# Altium schematic sheet PowerSupplies.SchDoc: Switching power supply
size 420 x 297 mm; CheckedBy: MC, TW, EB; CompanyName: CERN; DrawnBy: Greg Kasprowicz; Organization: CERN; Address1: European Organization for Nuclear Research; Address2: CH-1211 Geneve 23 - SwitzerLA_Pd; DocumentNumber: 3; Revision: -; SheetNumber: 11; SheetTotal: 15; EDA_Number: EDA-02189-V4-0; Projet: Simple PCIe Carrier Board; ModifiedBy: TW, MC; CreateDate: 10/07/2010; CheckedDate: 11/05/2011; DivGrp: BE-CO; Designer: GK, MC, TW, EB, PAS; PageSetup: Record=PageOptions|CenterHorizontal=True|CenterVertical=True|PrintScale=0.96|XCorrection=1.00|YCorrection=1.00|PrintKind=1|BorderSize=5000000|LeftOffset=0|BottomOffset=0|Orientation=2|PaperLength=1000|PaperWidth=1000|Scale=100|PaperSource=15|PrintQuality=600|MediaType=1|DitherType=10|PaperKind=A3|PrintScaleMode=1; ModifiedDate: -
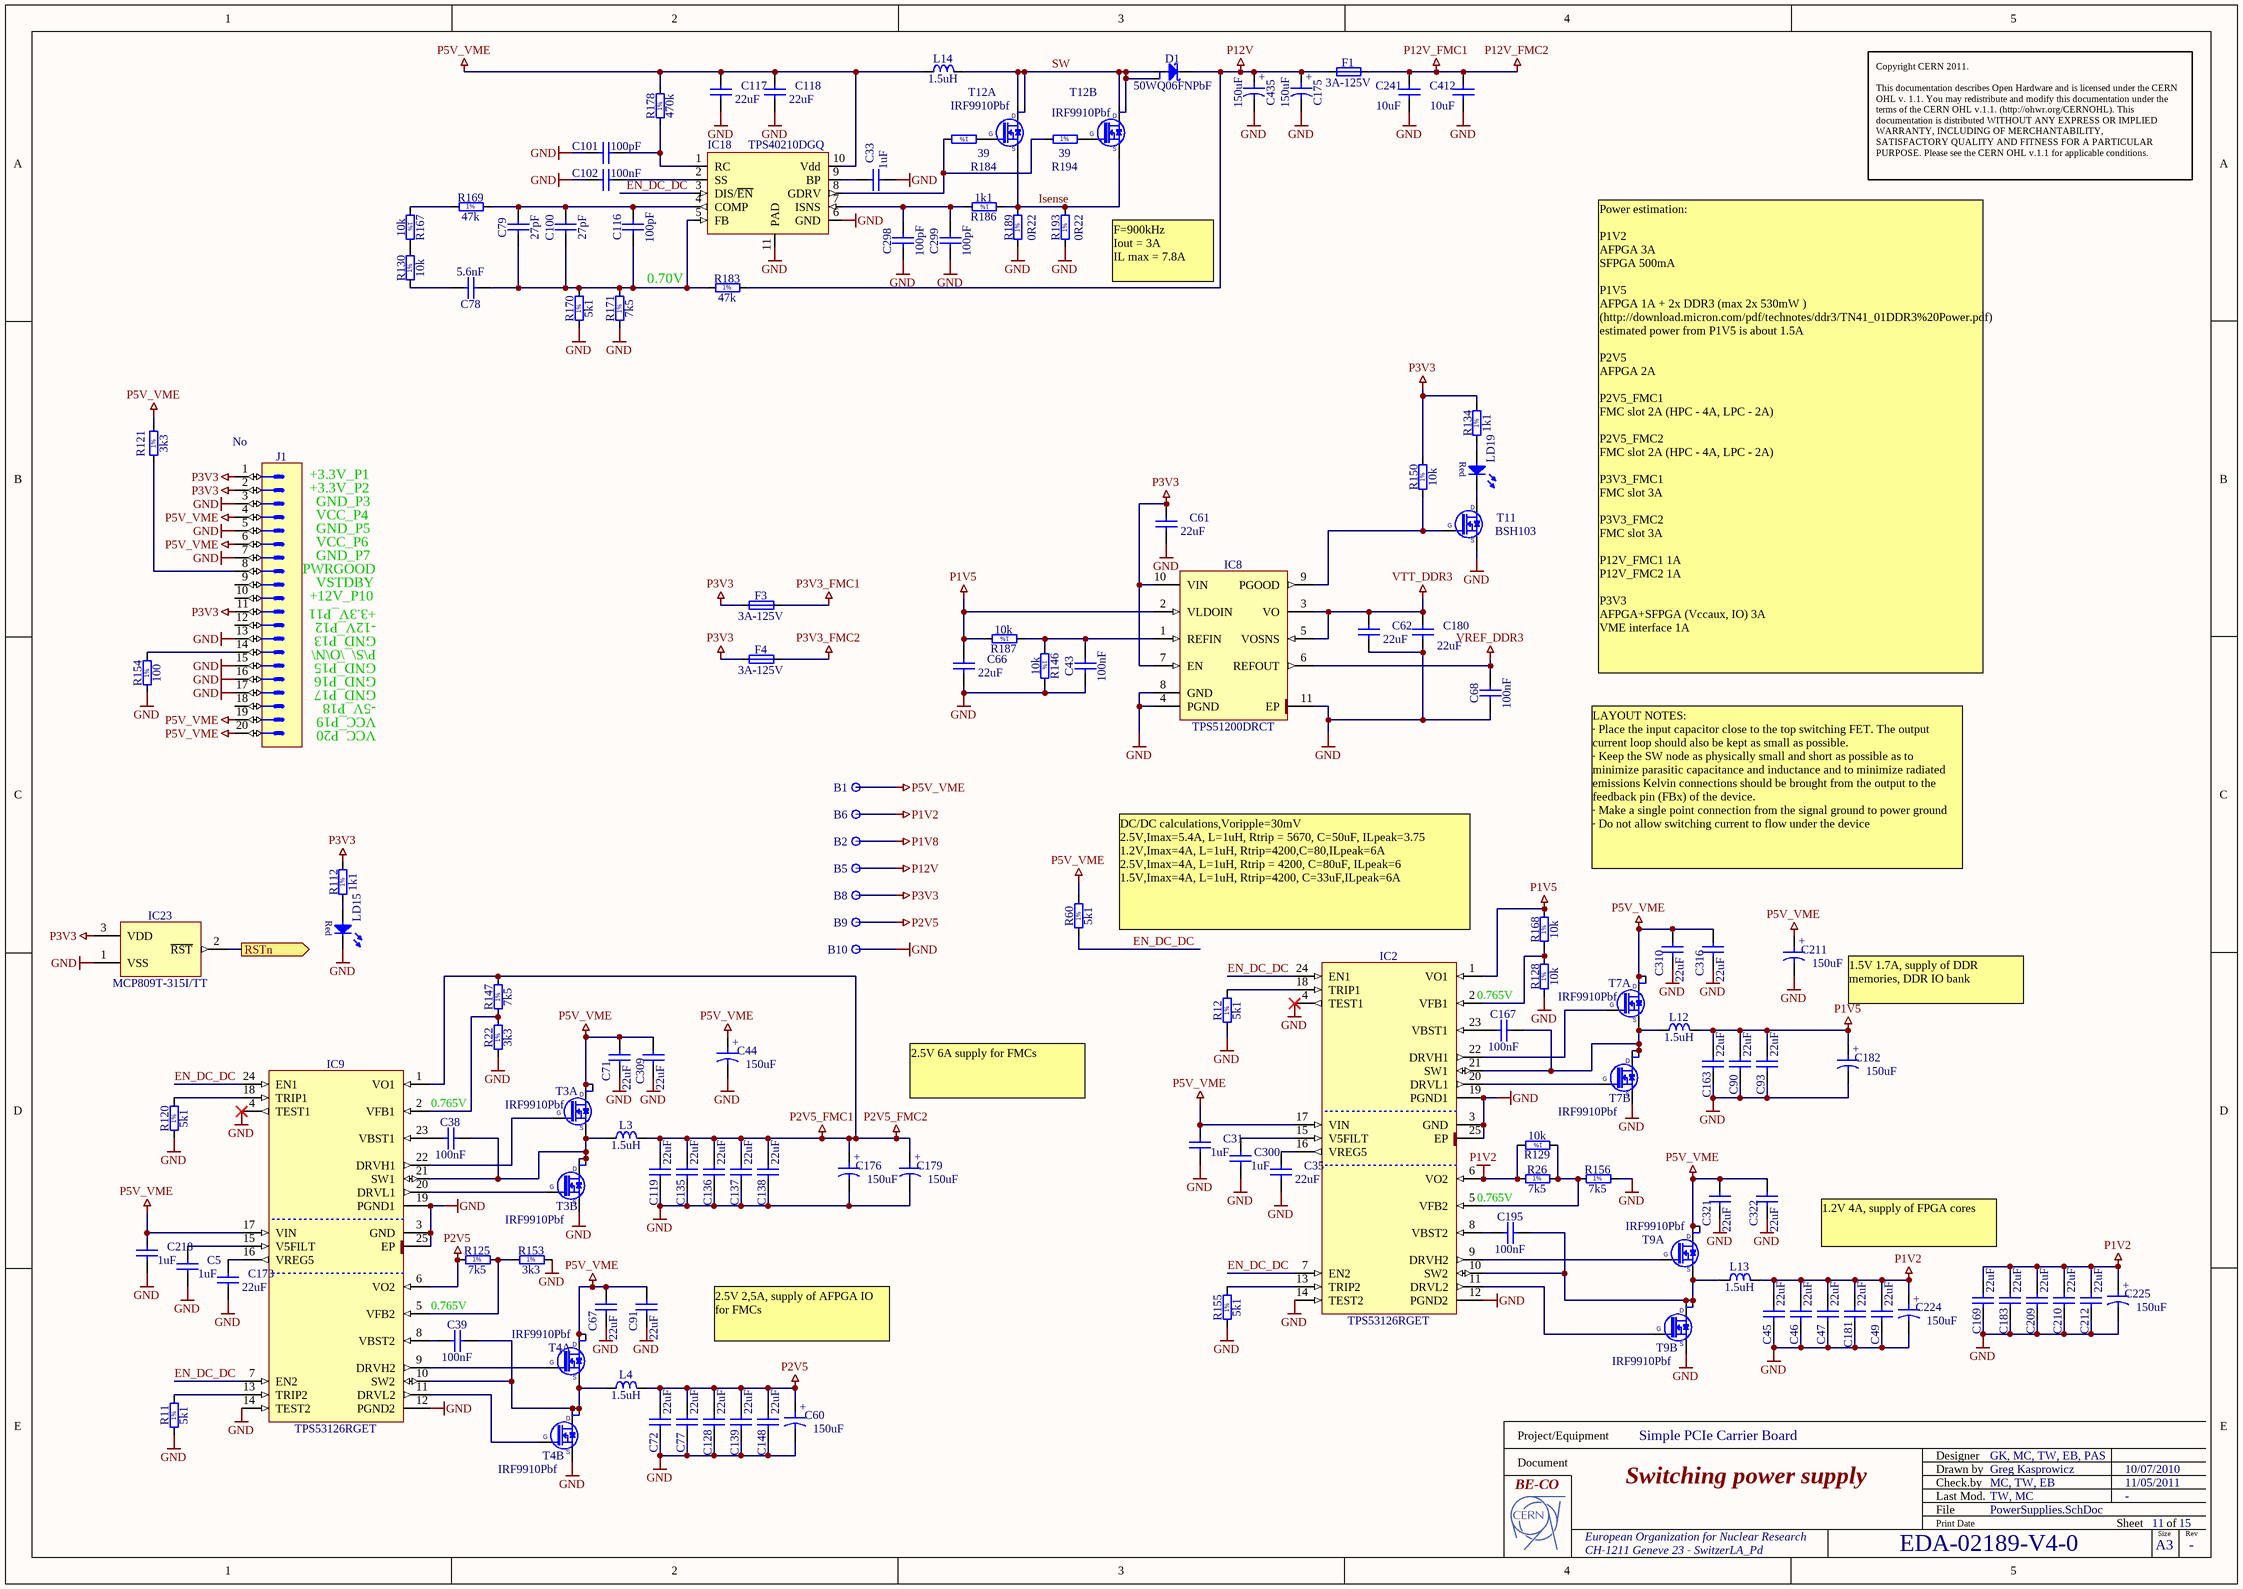
[diagram p0: PowerSupplies.SchDoc]

## Parts
B1  Plated Hole  [c130h80]  (value not drawn)
B2  Plated Hole  [c130h80]  (value not drawn)
B5  Plated Hole  [c130h80]  (value not drawn)
B6  Plated Hole  [c130h80]  (value not drawn)
B8  Plated Hole  [c130h80]  (value not drawn)
B9  Plated Hole  [c130h80]  (value not drawn)
B10  Plated Hole  [c130h80]  (value not drawn)
C5  1uF  [CAPC1608X87N]
C31  1uF  [CAPC1608X87N]
C33  1uF  [CAPC1608X87N]
C35  22uF  [CAPC3216X180N]
C38  100nF  [CAPC1005X55N]
C39  100nF  [CAPC1005X55N]
C43  100nF  [CAPC1005X55N]
C44  150uF  [CAPPR350-850X700]
C45  22uF  [CAPC3216X180N]
C46  22uF  [CAPC3216X180N]
C47  22uF  [CAPC3216X180N]
C49  22uF  [CAPC3216X180N]
C60  150uF  [CAPPR350-850X700]
C61  22uF  [CAPC3216X180N]
C62  22uF  [CAPC3216X180N]
C66  22uF  [CAPC3216X180N]
C67  22uF  [CAPC3216X180N]
C68  100nF  [CAPC1005X55N]
C71  22uF  [CAPC3216X180N]
C72  22uF  [CAPC3216X180N]
C77  22uF  [CAPC3216X180N]
C78  5.6nF  [CAPC1608X87N]
C79  27pF  [CAPC1608X87N]
C90  22uF  [CAPC3216X180N]
C91  22uF  [CAPC3216X180N]
C93  22uF  [CAPC3216X180N]
C100  27pF  [CAPC1608X87N]
C101  100pF  [CAPC1608X87N]
C102  100nF  [CAPC1005X55N]
C116  100pF  [CAPC1608X87N]
C117  22uF  [CAPC3216X180N]
C118  22uF  [CAPC3216X180N]
C119  22uF  [CAPC3216X180N]
C128  22uF  [CAPC3216X180N]
C135  22uF  [CAPC3216X180N]
C136  22uF  [CAPC3216X180N]
C137  22uF  [CAPC3216X180N]
C138  22uF  [CAPC3216X180N]
C139  22uF  [CAPC3216X180N]
C148  22uF  [CAPC3216X180N]
C163  22uF  [CAPC3216X180N]
C167  100nF  [CAPC1005X55N]
C169  22uF  [CAPC3216X180N]
C173  22uF  [CAPC3216X180N]
C175  150uF  [CAPPR500-1050X800]
C176  150uF  [CAPPR350-850X700]
C179  150uF  [CAPPR350-850X700]
C180  22uF  [CAPC3216X180N]
C181  22uF  [CAPC3216X180N]
C182  150uF  [CAPPR350-850X700]
C183  22uF  [CAPC3216X180N]
C195  100nF  [CAPC1005X55N]
C209  22uF  [CAPC3216X180N]
C210  22uF  [CAPC3216X180N]
C211  150uF  [CAPPR350-850X700]
C212  22uF  [CAPC3216X180N]
C218  1uF  [CAPC1608X87N]
C224  150uF  [CAPPR350-850X700]
C225  150uF  [CAPPR350-850X700]
C241  10uF  [CAPC3225X270N]
C298  100pF  [CAPC1608X87N]
C299  100pF  [CAPC1608X87N]
C300  1uF  [CAPC1608X87N]
C309  22uF  [CAPC3216X180N]
C310  22uF  [CAPC3216X180N]
C316  22uF  [CAPC3216X180N]
C321  22uF  [CAPC3216X180N]
C322  22uF  [CAPC3216X180N]
C412  10uF  [CAPC3225X270N]
C435  150uF  [CAPPR500-1050X800]
D1  50WQ06FNPbF  [TO228P991X239-3N-R546X521]
F1  3A-125V  [FUSE_LITTELFUSE_0154]
F3  3A-125V  [FUSE_LITTELFUSE_0154]
F4  3A-125V  [FUSE_LITTELFUSE_0154]
IC2  TPS53126RGET  [QFN50P400X400X100-25N-S255]
IC8  TPS51200DRCT  [SON50P300X300X100-11N-R175X250]
IC9  TPS53126RGET  [QFN50P400X400X100-25N-S255]
IC18  TPS40210DGQ  [MSOP10_thermal]
IC23  MCP809T-315I/TT  [SOT95P237X112-3N]
J1  Mounted: No  [MOLEX_39-28-1203]  (hidden comment: Mini-Fit Jr.™)
L3  1.5uH  [IND_BOURNS_SRR1260]
L4  1.5uH  [IND_BOURNS_SRR1260]
L12  1.5uH  [IND_BOURNS_SRR1260]
L13  1.5uH  [IND_BOURNS_SRR1260]
L14  1.5uH  [IND_BOURNS_SRR1260]
LD15  Red  [LEDC1608X80N_RED]  (value not drawn)
LD19  Red  [LEDC1608X80N_RED]  (value not drawn)
R11  5k1  [RESC1608X55N]
R12  5k1  [RESC1608X55N]
R22  3k3  [RESC1608X55N]
R26  7k5  [RESC1608X55N]
R60  5k1  [RESC1608X55N]
R112  1k1  [RESC1608X55N]
R120  5k1  [RESC1608X55N]
R121  3k3  [RESC1608X55N]
R125  7k5  [RESC1608X55N]
R128  10k  [RESC1608X55N]
R129  10k  [RESC1608X55N]
R130  10k  [RESC1608X55N]
R134  1k1  [RESC1608X55N]
R146  10k  [RESC1608X55N]
R147  7k5  [RESC1608X55N]
R150  10k  [RESC1608X55N]
R153  3k3  [RESC1608X55N]
R154  100  [RESC1608X55N]
R155  5k1  [RESC1608X55N]
R156  7k5  [RESC1608X55N]
R167  10k  [RESC1608X55N]
R168  10k  [RESC1608X55N]
R169  47k  [RESC1608X55N]
R170  5k1  [RESC1608X55N]
R171  7k5  [RESC1608X55N]
R178  470k  [RESC1608X55N]
R183  47k  [RESC1608X55N]
R184  39  [RESC1608X55N]
R186  1k1  [RESC1608X55N]
R187  10k  [RESC1608X55N]
R189  0R22  [RESC3216X65N]
R193  0R22  [RESC3216X65N]
R194  39  [RESC1608X55N]
T3  IRF9910Pbf  [SOIC127P600X175-8N]  (parts A,B of 2)
T4  IRF9910Pbf  [SOIC127P600X175-8N]  (parts A,B of 2)
T7  IRF9910Pbf  [SOIC127P600X175-8N]  (parts A,B of 2)
T9  IRF9910Pbf  [SOIC127P600X175-8N]  (parts A,B of 2)
T11  BSH103  [SOT95P230X110-3N]
T12  IRF9910Pbf  [SOIC127P600X175-8N]  (parts A,B of 2)

## Ports
RSTn (out)

## Nets
GND: B10.1 C5.1 C31.1 C33.1 C35.1 C43.1 C44.2 C45.1 C46.1 C47.1 C49.1 C60.2 C61.1 C62.1 C66.1 C67.1 C68.1 C71.1 C72.1 C77.1 C90.1 C91.1 C93.1 C101.1 C102.1 C117.1 C118.1 C119.1 C128.1 C135.1 C136.1 C137.1 C138.1 C139.1 C148.1 C163.1 C169.1 C173.1 C175.2 C176.2 C179.2 C180.1 C181.1 C182.2 C183.1 C209.1 C210.1 C211.2 C212.1 C218.1 C224.2 C225.2 C241.2 C298.1 C299.1 C300.1 C309.1 C310.1 C316.1 C321.1 C322.1 C412.2 C435.2 IC2.3(GND) IC2.4(TEST1) IC2.12(PGND2) IC2.14(TEST2) IC2.19(PGND1) IC2.25(EP) IC8.4(PGND) IC8.8(GND) IC8.11(EP) IC9.3(GND) IC9.4(TEST1) IC9.12(PGND2) IC9.14(TEST2) IC9.19(PGND1) IC9.25(EP) IC18.6(GND) IC18.11(PAD) IC23.1(VSS) J1.3 J1.5 J1.7 J1.13 J1.15 J1.16 J1.17 LD15.1(C) R11.1 R12.1 R22.1 R120.1 R128.1 R146.2 R153.2 R154.1 R155.1 R156.2 R170.1 R171.1 R189.1 R193.1 T3.1(S) T4.1(S) T7.1(S) T9.1(S) T11.2(S)
P1V2: B6.1 C45.2 C46.2 C47.2 C49.2 C169.2 C181.2 C183.2 C209.2 C210.2 C212.2 C224.1 C225.1 IC2.6(VO2) L13.2 R26.1 R129.2
P1V5: C66.2 C90.2 C93.2 C163.2 C182.1 IC2.1(VO1) IC8.2(VLDOIN) L12.2 R168.2 R187.2
P1V8: B2.1
P2V5: B9.1 C60.1 C72.2 C77.2 C128.2 C139.2 C148.2 IC9.6(VO2) L4.2 R125.1
P2V5_FMC1: C119.2 C135.2 C136.2 C137.2 C138.2 C176.1 C179.1 IC9.1(VO1) L3.2 R147.2  [also labelled P2V5_FMC2]
P3V3: B8.1 C61.2 F3.1 F4.1 IC8.7(EN) IC8.10(VIN) IC23.3(VDD) J1.1 J1.2 J1.11 R112.2 R134.2 R150.2
P3V3_FMC1: F3.2
P3V3_FMC2: F4.2
P5V_VME: B1.1 C31.2 C44.1 C67.2 C71.2 C91.2 C117.2 C118.2 C211.1 C218.2 C309.2 C310.2 C316.2 C321.2 C322.2 IC2.17(VIN) IC9.17(VIN) IC18.10(Vdd) J1.4 J1.6 J1.19 J1.20 L14.1 R60.2 R121.2 R178.2 T3.5(D) T3.6(D) T4.5(D) T4.6(D) T7.5(D) T7.6(D) T9.5(D) T9.6(D)
P12V: B5.1 C175.1 C435.1 D1.3(C) F1.1 R183.2
P12V_FMC1: C241.1 C412.1 F1.2  [also labelled P12V_FMC2]
VREF_DDR3: C68.2 IC8.6(REFOUT)
VTT_DDR3: C62.2 C180.2 IC8.3(VO) IC8.5(VOSNS)
EN_DC_DC: IC2.7(EN2) IC2.24(EN1) IC9.7(EN2) IC9.24(EN1) IC18.3(DIS/~{EN}) R60.1
Isense: R186.1 R189.2 R193.2 T12.1(S) T12.3(S)
RSTn: IC23.2(~{RST}) ; port RSTn
SW: D1.1(A) D1.2(A) L14.2 T12.5(D) T12.6(D) T12.7(D) T12.8(D)
NetC5_2: C5.2 IC9.15(V5FILT)
NetC33_2: C33.2 IC18.9(BP)
NetC35_2: C35.2 IC2.16(VREG5)
NetC38_1: C38.1 IC9.23(VBST1)
NetC38_2: C38.2 IC9.21(SW1) L3.1 T3.3(S) T3.7(D) T3.8(D)
NetC39_1: C39.1 IC9.8(VBST2)
NetC39_2: C39.2 IC9.10(SW2) L4.1 T4.3(S) T4.7(D) T4.8(D)
NetC43_2: C43.2 IC8.1(REFIN) R146.1 R187.1
NetC78_1: C78.1 C79.1 C100.1 C116.1 IC18.5(FB) R170.2 R171.2 R183.1
NetC78_2: C78.2 R130.1
NetC79_2: C79.2 C100.2 C116.2 IC18.4(COMP) R169.2
NetC101_2: C101.2 IC18.1(RC) R178.1
NetC102_2: C102.2 IC18.2(SS)
NetC167_1: C167.1 IC2.23(VBST1)
NetC167_2: C167.2 IC2.21(SW1) L12.1 T7.3(S) T7.7(D) T7.8(D)
NetC173_2: C173.2 IC9.16(VREG5)
NetC195_1: C195.1 IC2.8(VBST2)
NetC195_2: C195.2 IC2.10(SW2) L13.1 T9.3(S) T9.7(D) T9.8(D)
NetC298_2: C298.2 C299.2 IC18.7(ISNS) R186.2
NetC300_2: C300.2 IC2.15(V5FILT)
NetIC2_2: IC2.2(VFB1) R128.2 R168.1
NetIC2_5: IC2.5(VFB2) R26.2 R129.1 R156.1
NetIC2_9: IC2.9(DRVH2) T9.4(G)
NetIC2_11: IC2.11(DRVL2) T9.2(G)
NetIC2_13: IC2.13(TRIP2) R155.2
NetIC2_18: IC2.18(TRIP1) R12.2
NetIC2_20: IC2.20(DRVL1) T7.2(G)
NetIC2_22: IC2.22(DRVH1) T7.4(G)
NetIC8_9: IC8.9(PGOOD) R150.1 T11.1(G)
NetIC9_2: IC9.2(VFB1) R22.2 R147.1
NetIC9_5: IC9.5(VFB2) R125.2 R153.1
NetIC9_9: IC9.9(DRVH2) T4.4(G)
NetIC9_11: IC9.11(DRVL2) T4.2(G)
NetIC9_13: IC9.13(TRIP2) R11.2
NetIC9_18: IC9.18(TRIP1) R120.2
NetIC9_20: IC9.20(DRVL1) T3.2(G)
NetIC9_22: IC9.22(DRVH1) T3.4(G)
NetIC18_8: IC18.8(GDRV) R184.2 R194.1
NetJ1_8: J1.8 R121.1
NetJ1_14: J1.14 R154.2
NetLD15_2: LD15.2(A) R112.1
NetLD19_1: LD19.1(C) T11.3(D)
NetLD19_2: LD19.2(A) R134.1
NetR130_2: R130.2 R167.2
NetR167_1: R167.1 R169.1
NetR184_1: R184.1 T12.4(G)
NetR194_2: R194.2 T12.2(G)

Not connected (* = marked no-connect by the designer): J1 9 10 12 18

## Notes on the sheet
- Copyright CERN 2011.
  This documentation describes Open Hardware and is licensed under the CERN OHL v. 1.1. You may redistribute and modify this documentation under the terms of the CERN OHL v.1.1. (http://ohwr.org/CERNOHL). This documentation is distributed WITHOUT ANY EXPRESS OR IMPLIED WARRANTY, INCLUDING OF MERCHANTABILITY, SATISFACTORY QUALITY AND FITNESS FOR A PARTICULAR PURPOSE. Please see the CERN OHL v.1.1 for applicable conditions.
- 0.70V
- (near R193) F=900kHz
  Iout = 3A
  IL max = 7.8A
- (near J1) +3.3V_P1
- (near J1) +3.3V_P2
- GND_P3
- VCC_P4
- GND_P5
- (near J1) PWRGOOD
- VCC_P6
- GND_P7
- VSTDBY
- (near J1) +12V_P10
- (near J1) +3.3V_P11
- -12V_P12
- GND_P13
- (near J1) P\S\_\O\N\
- GND_P15
- GND_P16
- Power estimation:
  P1V2
  AFPGA 3A
  SFPGA 500mA
  P1V5
  AFPGA 1A + 2x DDR3 (max 2x 530mW )
  (http://download.micron.com/pdf/technotes/ddr3/TN41_01DDR3%20Power.pdf)
  estimated power from P1V5 is about 1.5A
  P2V5
  AFPGA 2A
  P2V5_FMC1
  FMC slot 2A (HPC - 4A, LPC - 2A)
  P2V5_FMC2
  FMC slot 2A (HPC - 4A, LPC - 2A)
  P3V3_FMC1
  FMC slot 3A
  P3V3_FMC2
  FMC slot 3A
  P12V_FMC1 1A
  P12V_FMC2 1A
  P3V3
  AFPGA+SFPGA (Vccaux, IO) 3A
  VME interface 1A
- GND_P17
- -5V_P18
- VCC_P19
- VCC_P20
- LAYOUT NOTES:
  · Place the input capacitor close to the top switching FET. The output current loop should also be kept as small as possible.
  · Keep the SW node as physically small and short as possible as to minimize parasitic capacitance and inductance and to minimize radiated emissions Kelvin connections should be brought from the output to the feedback pin (FBx) of the device.
  · Make a single point connection from the signal ground to power ground
  · Do not allow switching current to flow under the device
- DC/DC calculations,Voripple=30mV
  2.5V,Imax=5.4A, L=1uH, Rtrip = 5670, C=50uF, ILpeak=3.75
  1.2V,Imax=4A, L=1uH, Rtrip=4200,C=80,ILpeak=6A
  2.5V,Imax=4A, L=1uH, Rtrip = 4200, C=80uF, ILpeak=6
  1.5V,Imax=4A, L=1uH, Rtrip=4200, C=33uF,ILpeak=6A
- 0.765V
- 1.5V 1.7A, supply of DDR memories, DDR IO bank
- 2.5V 6A supply for FMCs
- 1.2V 4A, supply of FPGA cores
- 2.5V 2,5A, supply of AFPGA IO for FMCs
- Project/Equipment
- Document
- Designer
- Drawn by
- Check.by
- File
- Last Mod.
- Print Date
- Sheet
- Size
- A3
- of
- Rev
- (in symbol CAER_150UF_6.3V_20%_SANYO_6SEQP150M) +
- (in symbol CAER_150UF_16V_20%_SANYO_16SEQP150M) +
- (in symbol R0603_1K1_1%_0.1W_100PPM) 1%
- (in symbol R0603_3K3_1%_0.1W_100PPM) 1%
- (in symbol R0603_5K1_1%_0.1W_100PPM) 1%
- (in symbol R0603_7K5_1%_0.1W_100PPM) 1%
- (in symbol R0603_10K_1%_0.1W_100PPM) 1%
- (in symbol R0603_39R_1%_0.1W_100PPM) 1%
- (in symbol R0603_47K_1%_0.1W_100PPM) 1%
- (in symbol R0603_100R_1%_0.1W_100PPM) 1%
- (in symbol R0603_470K_1%_0.1W_100PPM) 1%
- (in symbol R1206_0R22_1%_0.5W_600PPM) 1%

## Library data of the parts
B1 B2 B5 B6 B8-B10 = PLATED_HOLE0.8_PAD1.3: Single Terminal Socket; Part Description: Plated Through Hole: Hole Dia.=0.8mm Pad Dia.=1.3mm; Mounted: No; Table: Pads; Part Number: PLATED_HOLE0.8_PAD1.3; Component Kind: Standard (No BOM); Component Type: Standard (No BOM); Pin Count: 1; Family: Plated Hole; Socket: No; SMD: No; Status: None; ComponentHeight: 0mm; Author: CERN DEM JLC; CreateDate: 2008-10-30; LatestRevisionDate: 2008-10-30; PackageDescription: Plated Through Hole: Hole Dia.=0.8mm Pad Dia.=1.3mm
C5 C31 C33 C218 C300 = CC0603_1UF_16V_10%_X7R: Non-polarised capacitor; Part Description: SMD Multilayer Chip Ceramic Capacitor; Manufacturer: GENERIC; Manufacturer1 Part Number: 223824613663; Voltage: 16V; TC: X7R; Tolerance: ±10%; Table: Capacitors SMD; Part Number: CC0603_1UF_16V_10%_X7R; Component Kind: Standard; Component Type: Standard; Pin Count: 2; Value: 1uF; Status: Preferred; Manufacturer Part Number: CC0603_1uF_16V_10%_X7R; Case: 0603; Mounted: Yes; Socket: No; SMD: Yes; Manufacturer1 Example: PHYCOMP; Manufacturer1 ComponentHeight: 0.87mm; HelpURL: \\cern.ch\dfs\Applications\Altium\Datasheets\CC0805_X5R_PHYCOMP_HC.pdf; Author: CERN DEM JLC
  C5 C33 C300: CreateDate: 03/12/2007; LatestRevisionDate: 03/12/2007
  C31 C218: CreateDate: 12/3/2007; LatestRevisionDate: 12/3/2007
C35 C45-C47 C49 C61 C62 C66 C67 C71 C72 C77 C90 C91 C93 C117-C119 C128 C135-C139 C148 C163 C169 C173 C180 C181 C183 C209 C210 C212 C309 C310 C316 C321 C322 = CC1206_22UF_10V_10%_X7R: Non-polarised capacitor; Part Description: SMD Multilayer Chip Ceramic Capacitor; Manufacturer: GENERIC; Manufacturer1 Part Number: GRM31CR71A226KE15L; Voltage: 10V; TC: X7R; Tolerance: ±10%; Table: Capacitors SMD; Part Number: CC1206_22UF_10V_10%_X7R; Component Kind: Standard; Component Type: Standard; Pin Count: 2; Value: 22uF; Status: Preferred; Manufacturer Part Number: CC1206_22UF_10V_10%_X7R; Case: 1206; Mounted: Yes; Socket: No; SMD: Yes; Manufacturer1 Example: MURATA; Manufacturer1 ComponentHeight: 1.8mm; HelpURL: \\cern.ch\dfs\Applications\Altium\Datasheets\CC1206_X7R_MURATA_GRM-HI-CAP.pdf; Author: CERN DEM JLC; CreateDate: 2010-06-08; LatestRevisionDate: 2010-06-08
C38 C39 C43 C102 C167 C195 = CC0402_100NF_16V_10%_X7R: Non-polarised capacitor; Part Description: SMD Multilayer Chip Ceramic Capacitor; Manufacturer: GENERIC; Manufacturer1 Part Number: 223878715649; Voltage: 16V; TC: X7R; Tolerance: ±10%; Table: Capacitors SMD; Part Number: CC0402_100NF_16V_10%_X7R; Component Kind: Standard; Component Type: Standard; Pin Count: 2; Value: 100nF; Status: Not Recommended; Manufacturer Part Number: CC0402_100NF_16V_10%_X7R; Case: 0402; Mounted: Yes; Socket: No; SMD: Yes; Manufacturer1 Example: PHYCOMP; Manufacturer1 ComponentHeight: 0.55mm; HelpURL: \\cern.ch\dfs\Applications\Altium\Datasheets\CC0402_X7R_PHYCOMP.pdf; Author: CERN DEM JLC
  C38 C39 C102 C167 C195: CreateDate: 2007-12-03; LatestRevisionDate: 2007-12-03
  C43: CreateDate: 12/3/2007; LatestRevisionDate: 12/3/2007
C44 C60 C176 C179 C182 C211 C224 C225 = CAER_150UF_6.3V_20%_SANYO_6SEQP150M: Polarised capacitor; Part Description: Aluminium Solid Capacitor With Conductive Polymer (SEQP Serie); Manufacturer: SANYO OS-CON; Voltage: 6.3V; Tolerance: ±20%; Table: Capacitors THD; Part Number: CAER_150UF_6.3V_20%_SANYO_6SEQP150M; Component Kind: Standard; Component Type: Standard; Pin Count: 2; Value: 150uF; Status: Not Recommended; Manufacturer Part Number: 6SEQP150M; Case: LS3.5 D8 x H7; Mounted: Yes; Socket: No; SMD: No; ComponentHeight: 7mm; HelpURL: \\cern.ch\dfs\Applications\Altium\Datasheets\CAER_SANYO_SEQP.pdf; Author: CERN DEM JLC; CreateDate: 2011-03-07; LatestRevisionDate: 2011-03-07
C68 = CC0402_100NF_16V_10%_X7R: Non-polarised capacitor; Part Description: SMD Multilayer Chip Ceramic Capacitor; Manufacturer: GENERIC; Manufacturer1 Part Number: 223878715649; Manufacturer1 Datasheet: \\cern.ch\dfs\Applications\Altium\Datasheets\CC0402_X7R_PHYCOMP.pdf; Voltage: 16V; TC: X7R; Tolerance: ±10%; Table: Capacitors SMD; Part Number: CC0402_100NF_16V_10%_X7R; Component Kind: Standard; Component Type: Standard; Designator: Capacitor - non polarized; Library Reference: Capacitor - non polarized; Pin Count: 2; Value: 100nF; Status: Not Recommended; Manufacturer Part Number: CC0402_100NF_16V_10%_X7R; Case: 0402; Mounted: Yes; Socket: No; SMD: Yes; Manufacturer1 Example: PHYCOMP; Manufacturer1 ComponentHeight: 0.55mm; HelpURL: \\cern.ch\dfs\Applications\Altium\Datasheets\CC0402_X7R_PHYCOMP.pdf; Author: CERN DEM JLC; CreateDate: 12/3/2007; LatestRevisionDate: 12/3/2007
C78 = CC0603_5.6NF_50V_5%_X7R: Non-polarised capacitor; Part Description: SMD Multilayer Chip Ceramic Capacitor; Manufacturer: GENERIC; Manufacturer1 Part Number: 223858615633; Voltage: 50V; TC: X7R; Tolerance: ±5%; Table: Capacitors SMD; Part Number: CC0603_5.6NF_50V_5%_X7R; Component Kind: Standard; Component Type: Standard; Pin Count: 2; Value: 5.6nF; Status: Preferred; Manufacturer Part Number: CC0603_5.6NF_50V_5%_X7R; Case: 0603; Mounted: Yes; Socket: No; SMD: Yes; Manufacturer1 Example: PHYCOMP; Manufacturer1 ComponentHeight: 0.87mm; HelpURL: \\cern.ch\dfs\Applications\Altium\Datasheets\CC0603_X7R_PHYCOMP.pdf; Author: CERN DEM JLC; CreateDate: 2007-12-03; LatestRevisionDate: 2007-12-03
C79 C100 = CC0603_27PF_50V_5%_NP0: Non-polarised capacitor; Part Description: SMD Multilayer Chip Ceramic Capacitor; Manufacturer: GENERIC; Manufacturer1 Part Number: 223886715279; Voltage: 50V; TC: NP0; Tolerance: ±5%; Mounted: No; Table: Capacitors SMD; Part Number: CC0603_27PF_50V_5%_NP0; Component Kind: Standard; Component Type: Standard; Pin Count: 2; Value: 27pF; Status: Preferred; Manufacturer Part Number: CC0603_27PF_50V_5%_NP0; Case: 0603; Socket: No; SMD: Yes; Manufacturer1 Example: PHYCOMP; Manufacturer1 ComponentHeight: 0.87mm; HelpURL: \\cern.ch\dfs\Applications\Altium\Datasheets\CC0603_NP0_PHYCOMP.pdf; Author: CERN DEM JLC; CreateDate: 2007-12-03; LatestRevisionDate: 2007-12-03
C101 C116 C298 C299 = CC0603_100PF_50V_5%_NP0: Non-polarised capacitor; Part Description: SMD Multilayer Chip Ceramic Capacitor; Manufacturer: GENERIC; Manufacturer1 Part Number: 223886715101; Voltage: 50V; TC: NP0; Tolerance: ±5%; Table: Capacitors SMD; Part Number: CC0603_100PF_50V_5%_NP0; Component Kind: Standard; Component Type: Standard; Pin Count: 2; Value: 100pF; Status: Preferred; Manufacturer Part Number: CC0603_100PF_50V_5%_NP0; Case: 0603; Mounted: Yes; Socket: No; SMD: Yes; Manufacturer1 Example: PHYCOMP; Manufacturer1 ComponentHeight: 0.87mm; HelpURL: \\cern.ch\dfs\Applications\Altium\Datasheets\CC0603_NP0_PHYCOMP.pdf; Author: CERN DEM JLC; CreateDate: 2007-12-03; LatestRevisionDate: 2007-12-03
C175 C435 = CAER_150UF_16V_20%_SANYO_16SEQP150M: Polarised capacitor; Part Description: Aluminium Solid Capacitor With Conductive Polymer (SEQP Serie); Manufacturer: SANYO OS-CON; Voltage: 16V; Tolerance: ±20%; Table: Capacitors THD; Part Number: CAER_150UF_16V_20%_SANYO_16SEQP150M; Component Kind: Standard; Component Type: Standard; Pin Count: 2; Value: 150uF; Status: Not Recommended; Manufacturer Part Number: 16SEQP150M; Case: LS5 D10 x H8; Mounted: Yes; Socket: No; SMD: No; ComponentHeight: 8mm; HelpURL: \\cern.ch\dfs\Applications\Altium\Datasheets\CAER_SANYO_SEQP.pdf; Author: CERN DEM JLC; CreateDate: 2011-03-07; LatestRevisionDate: 2011-03-07
C241 C412 = CC1210_10UF_25V_10%_X7R: Non-polarised capacitor; Part Description: SMD Multilayer Chip Ceramic Capacitor; Manufacturer: GENERIC; Manufacturer1 Part Number: C1210C106K3RAC; Voltage: 25V; TC: X7R; Tolerance: ±10%; Table: Capacitors SMD; Part Number: CC1210_10UF_25V_10%_X7R; Component Kind: Standard; Component Type: Standard; Pin Count: 2; Value: 10uF; Status: None; Manufacturer Part Number: CC1210_10UF_25V_10%_X7R; Case: 1210; Mounted: Yes; Socket: No; SMD: Yes; Manufacturer1 Example: KEMET; Manufacturer1 ComponentHeight: 2.7mm; HelpURL: \\cern.ch\dfs\Applications\Altium\Datasheets\CC1210_X7R_KEMET.pdf; Author: CERN DEM JLC; CreateDate: 5/5/2009; LatestRevisionDate: 4/1/2010
D1 = 50WQ06FNPbF: Diode  Schottky Anode pin 1 and 2 cathode pin 3; Part Description: Schottky Rectifier; Manufacturer: VISHAY SEMICONDUCTOR; Voltage: 60V; Power: 5.5A; Table: Diodes; Part Number: 50WQ06FNPbF; Component Kind: Standard; Component Type: Standard; Device: 50WQ06FNPbF; PackageDescription: TO-252AA DPAK TO, 2.28mm pitch; 2 pin,9.905mm L X 6.095mm W X 2.39mm H body, IPC Medium Density; Manufacturer Part Number: 50WQ06FNPbF; Pin Count: 3; Case: D-PACK; Mounted: Yes; Socket: No; SMD: Yes; ComponentHeight: 2.39mm; HelpURL: \\cern.ch\dfs\Applications\Altium\Datasheets\50WQ06FNPbF.pdf; Author: CERN DEM JLC; CreateDate: 2009-05-04; LatestRevisionDate: 2009-09-21
F1 F3 F4 = FUSE_LITTELFUSE_0154003.DR: Fuse; Part Description: SMF OMNI-BLOK® Very Fast-Acting Fuse and Holder; Table: Fuses; Part Number: FUSE_LITTELFUSE_0154003.DR; Component Kind: Standard; Component Type: Standard; Pin Count: 2; PackageDescription: SMF Fuse and Holder, 2-Leads, Body 9.73x5.03mm; Family: Fuse & Holder; Mounted: Yes; Socket: No; SMD: Yes; Value: 3A-125V; Manufacturer: LITTELFUSE; Manufacturer Part Number: 0154003.DR; ComponentHeight: 3.81mm; HelpURL: \\cern.ch\dfs\Applications\Altium\Datasheets\FUSE_LITTELFUSE_0154.pdf; Author: CERN DEM JMW; CreateDate: 1/8/2009; LatestRevisionDate: 1/8/2009
IC2 IC9 = TPS53126RGET: Dual Synchronous Step-Down Controller For Low Voltage Power Rails; Manufacturer: TEXAS INSTRUMENTS; Table: Analog & Interface; Part Number: TPS53126RGET; Component Kind: Standard; Component Type: Standard; Device: TPS53126RGET; PackageDescription: QFN,0.50mm pitch,square;6 pin X 6 pin,4.15mm X 4.15mm X 1.00mm H body (w/thermal tab 2.55 X 2.55mm),  IPC Medium Density; Part Description: Dual Synchronous Step-Down Controller For Low Voltage Power Rails; Manufacturer Part Number: TPS53126RGET; Pin Count: 25; Case: QFN24; Mounted: Yes; Socket: No; SMD: Yes; ComponentHeight: 1.0mm; Author: CERN DEM JLC; HelpURL: \\cern.ch\dfs\Applications\Altium\Datasheets\TPS53126RGET.pdf; CreateDate: 2010-08-26; LatestRevisionDate: 2010-08-26
IC8 = TPS51200DRCT: Sink/Source DDR Termination Regulator; Part Description: 3.3V Sink/Source DDR Termination Regulator; Manufacturer: TEXAS INSTRUMENTS; Table: Regulators; Part Number: TPS51200DRCT; Component Kind: Standard; Component Type: Standard; Device: TPS51200DRCT; PackageDescription: SON, 0.50mm Pitch, 10-pin, 3.00mm W  X 3.00mm L X 1.00mm Height, (w/thermal tab 1.75 X 2.50 mm), IPC Medium Density; Manufacturer Part Number: TPS51200DRCT; Pin Count: 10; Case: SON10; Mounted: Yes; Socket: No; SMD: Yes; ComponentHeight: 1mm; HelpURL: \\cern.ch\dfs\Applications\Altium\Datasheets\TPS51200DRCT.pdf; Author: CERN DEM JLC; CreateDate: 2/3/2010; LatestRevisionDate: 2/3/2010
IC18 = PM_TPS40210: 4.5-V TO 52-V CURRENT MODE BOOST CONTROLLER
IC23 = MCP809T-315I/TT: 3.075V Microcontroller Supervisory Circuit With Push-Pull Output; Manufacturer: MICROCHIP TECHNOLOGY; Table: Analog & Interface; Part Number: MCP809T-315I/TT; Component Kind: Standard; Component Type: Standard; Device: MCP809T-315I/TT; PackageDescription: SOT, 0.95mm, pitch; 3 pin,1.30mm W X 2.92mm L X 1.12mm H body, IPC Medium Density; Part Description: 3.075V Microcontroller Supervisory Circuit With Push-Pull Output; Manufacturer Part Number: MCP809T-315I/TT; Pin Count: 3; Case: SOT23; Mounted: Yes; Socket: No; SMD: Yes; ComponentHeight: 1.12mm; Author: CERN DEM JLC; HelpURL: \\cern.ch\dfs\Applications\Altium\Datasheets\MCP809T-315I-TT.pdf; CreateDate: 2011-06-16; LatestRevisionDate: 2011-06-16
J1 = MOLEX_39-28-1203: Connector 20 Male; Part Description: 4.20mm (.165") Pitch Mini-Fit Jr.™ Header, Dual Row, Vertical, without Snap-in Plastic Peg PCB Lock, 20 Circuits; Manufacturer: MOLEX; Part Number: MOLEX_39-28-1203; Component Kind: Standard; Component Type: Standard; Pin Count: 20; Family: Mini-Fit Jr.™; Socket: No; SMD: No; Status: None; Manufacturer Part Number: 39-28-1203; ComponentHeight: 13.1mm; HelpURL: \\cern.ch\dfs\Applications\Altium\Datasheets\MOLEX_39-28-1203.pdf; Author: CERN DEM JLC; CreateDate: 2012-03-06; LatestRevisionDate: 2012-03-06; Table: MOLEX
L3 L4 L12-L14 = IND_1.5UH_30%_BOURNS_SRR1260: Inductor; Part Description: Shielded SMD Power Inductors; Manufacturer: BOURNS; Manufacturer Part Number: SRR1260-1R5Y; Power: 8.8A; Resistance: 0.0095R; Tolerance: ±30%; Table: Inductors SMD; Part Number: IND_1.5UH_30%_BOURNS_SRR1260; Component Kind: Standard; Component Type: Standard; Pin Count: 2; Value: 1.5uH; Status: None; Mounted: Yes; Socket: No; SMD: Yes; ComponentHeight: 6.5mm; HelpURL: \\cern.ch\dfs\Applications\Altium\Datasheets\IND_BOURNS_SRR1260.pdf; Author: CERN DEM JLC; CreateDate: 2010-08-30; LatestRevisionDate: 2010-08-30
LD15 LD19 = LED_ROHM_SML-311UTT86K: LED Red 1C 2A; Part Description: Low current chip LED SML-311 Serie; Manufacturer: ROHM; Table: LEDs & Displays; Part Number: LED_ROHM_SML-311UTT86K; Component Kind: Standard; Component Type: Standard; Color: Red; PackageDescription: Chip RED LED, 2-Leads, Body 1.6x0.8mm, IPC Medium Density; Manufacturer Part Number: SML-311UTT86K; Pin Count: 2; Mounted: Yes; Socket: No; SMD: Yes; ComponentHeight: 0.8mm; HelpURL: \\cern.ch\dfs\Applications\Altium\Datasheets\LED_ROHM_SML-311UTT86K.pdf; Author: CERN DEM JLC; CreateDate: 3/16/2010; LatestRevisionDate: 3/17/2010
R11 R12 R60 R120 R155 R170 = R0603_5K1_1%_0.1W_100PPM: Resistor - 1%; Part Description: General Purpose Thick Film Chip Resistor; Manufacturer: GENERIC; Manufacturer1 Part Number: NRC06F5101TRF; Power: 0.1W; TC: ±100ppm/°C; Table: Resistors SMD; Part Number: R0603_5K1_1%_0.1W_100PPM; Component Kind: Standard; Component Type: Standard; Pin Count: 2; Value: 5k1; Status: Preferred; Tolerance: ±1%; Manufacturer Part Number: R0603_5K1_1%_0.1W_100PPM; Case: 0603; Mounted: Yes; Socket: No; SMD: Yes; Manufacturer1 Example: NIC COMPONENT; Manufacturer1 ComponentHeight: 0.55mm; HelpURL: \\cern.ch\dfs\Applications\Altium\Datasheets\R0603_NIC_NRC.pdf; Author: CERN DEM JLC; CreateDate: 12/3/2007; LatestRevisionDate: 3/13/2008
R22 R121 R153 = R0603_3K3_1%_0.1W_100PPM: Resistor - 1%; Part Description: General Purpose Thick Film Chip Resistor; Manufacturer: GENERIC; Manufacturer1 Part Number: NRC06F3301TRF; Power: 0.1W; TC: ±100ppm/°C; Table: Resistors SMD; Part Number: R0603_3K3_1%_0.1W_100PPM; Component Kind: Standard; Component Type: Standard; Pin Count: 2; Value: 3k3; Status: Preferred; Tolerance: ±1%; Manufacturer Part Number: R0603_3K3_1%_0.1W_100PPM; Case: 0603; Mounted: Yes; Socket: No; SMD: Yes; Manufacturer1 Example: NIC COMPONENT; Manufacturer1 ComponentHeight: 0.55mm; HelpURL: \\cern.ch\dfs\Applications\Altium\Datasheets\R0603_NIC_NRC.pdf; Author: CERN DEM JLC; CreateDate: 2007-12-03; LatestRevisionDate: 2008-03-13
R26 R125 R147 R156 R171 = R0603_7K5_1%_0.1W_100PPM: Resistor - 1%; Part Description: General Purpose Thick Film Chip Resistor; Manufacturer: GENERIC; Manufacturer1 Part Number: NRC06F7501TRF; Power: 0.1W; TC: ±100ppm/°C; Table: Resistors SMD; Part Number: R0603_7K5_1%_0.1W_100PPM; Component Kind: Standard; Component Type: Standard; Pin Count: 2; Value: 7k5; Status: Preferred; Tolerance: ±1%; Manufacturer Part Number: R0603_7K5_1%_0.1W_100PPM; Case: 0603; Mounted: Yes; Socket: No; SMD: Yes; Manufacturer1 Example: NIC COMPONENT; Manufacturer1 ComponentHeight: 0.55mm; HelpURL: \\cern.ch\dfs\Applications\Altium\Datasheets\R0603_NIC_NRC.pdf; Author: CERN DEM JLC; CreateDate: 2007-12-03; LatestRevisionDate: 2008-03-13
R112 R134 R186 = R0603_1K1_1%_0.1W_100PPM: Resistor - 1%; Part Description: General Purpose Thick Film Chip Resistor; Manufacturer: GENERIC; Manufacturer1 Part Number: NRC06F1101TRF; Power: 0.1W; TC: ±100ppm/°C; Table: Resistors SMD; Part Number: R0603_1K1_1%_0.1W_100PPM; Component Kind: Standard; Component Type: Standard; Pin Count: 2; Value: 1k1; Status: Preferred; Tolerance: ±1%; Manufacturer Part Number: R0603_1K1_1%_0.1W_100PPM; Case: 0603; Mounted: Yes; Socket: No; SMD: Yes; Manufacturer1 Example: NIC COMPONENT; Manufacturer1 ComponentHeight: 0.55mm; HelpURL: \\cern.ch\dfs\Applications\Altium\Datasheets\R0603_NIC_NRC.pdf; Author: CERN DEM JLC; CreateDate: 2007-12-03; LatestRevisionDate: 2008-03-13
R128-R130 R146 R150 R167 R168 R187 = R0603_10K_1%_0.1W_100PPM: Resistor - 1%; Part Description: General Purpose Thick Film Chip Resistor; Manufacturer: GENERIC; Manufacturer1 Part Number: NRC06F1002TRF; Power: 0.1W; TC: ±100ppm/°C; Table: Resistors SMD; Part Number: R0603_10K_1%_0.1W_100PPM; Component Kind: Standard; Component Type: Standard; Pin Count: 2; Value: 10k; Status: Preferred; Tolerance: ±1%; Manufacturer Part Number: R0603_10K_1%_0.1W_100PPM; Case: 0603; Mounted: Yes; Socket: No; SMD: Yes; Manufacturer1 Example: NIC COMPONENT; Manufacturer1 ComponentHeight: 0.55mm; HelpURL: \\cern.ch\dfs\Applications\Altium\Datasheets\R0603_NIC_NRC.pdf; Author: CERN DEM JLC
  R128 R129 R168: CreateDate: 12/3/2007; LatestRevisionDate: 3/13/2008
  R130 R146 R150 R167 R187: CreateDate: 2007-12-03; LatestRevisionDate: 2008-03-13
R154 = R0603_100R_1%_0.1W_100PPM: Resistor - 1%; Part Description: General Purpose Thick Film Chip Resistor; Manufacturer: GENERIC; Manufacturer1 Part Number: NRC06F4700TRF; Power: 0.1W; TC: ±100ppm/°C; Table: Resistors SMD; Part Number: R0603_100R_1%_0.1W_100PPM; Component Kind: Standard; Component Type: Standard; Pin Count: 2; Value: 100; Status: Preferred; Tolerance: ±1%; Manufacturer Part Number: R0603_100R_1%_0.1W_100PPM; Case: 0603; Mounted: Yes; Socket: No; SMD: Yes; Manufacturer1 Example: NIC COMPONENT; Manufacturer1 ComponentHeight: 0.55mm; HelpURL: \\cern.ch\dfs\Applications\Altium\Datasheets\R0603_NIC_NRC.pdf; Author: CERN DEM JLC; CreateDate: 2007-12-03; LatestRevisionDate: 2008-03-13
R169 R183 = R0603_47K_1%_0.1W_100PPM: Resistor - 1%; Part Description: General Purpose Thick Film Chip Resistor; Manufacturer: GENERIC; Manufacturer1 Part Number: NRC06F4702TRF; Power: 0.1W; TC: ±100ppm/°C; Table: Resistors SMD; Part Number: R0603_47K_1%_0.1W_100PPM; Component Kind: Standard; Component Type: Standard; Pin Count: 2; Value: 47k; Status: Preferred; Tolerance: ±1%; Manufacturer Part Number: R0603_47K_1%_0.1W_100PPM; Case: 0603; Mounted: Yes; Socket: No; SMD: Yes; Manufacturer1 Example: NIC COMPONENT; Manufacturer1 ComponentHeight: 0.55mm; HelpURL: \\cern.ch\dfs\Applications\Altium\Datasheets\R0603_NIC_NRC.pdf; Author: CERN DEM JLC; CreateDate: 2007-12-03; LatestRevisionDate: 2008-03-13
R178 = R0603_470K_1%_0.1W_100PPM: Resistor - 1%; Part Description: General Purpose Thick Film Chip Resistor; Manufacturer: GENERIC; Manufacturer1 Part Number: NRC06F4703TRF; Power: 0.1W; TC: ±100ppm/°C; Table: Resistors SMD; Part Number: R0603_470K_1%_0.1W_100PPM; Component Kind: Standard; Component Type: Standard; Pin Count: 2; Value: 470k; Status: Preferred; Tolerance: ±1%; Manufacturer Part Number: R0603_470K_1%_0.1W_100PPM; Case: 0603; Mounted: Yes; Socket: No; SMD: Yes; Manufacturer1 Example: NIC COMPONENT; Manufacturer1 ComponentHeight: 0.55mm; HelpURL: \\cern.ch\dfs\Applications\Altium\Datasheets\R0603_NIC_NRC.pdf; Author: CERN DEM JLC; CreateDate: 2007-12-03; LatestRevisionDate: 2008-03-13
R184 R194 = R0603_39R_1%_0.1W_100PPM: Resistor - 1%; Part Description: General Purpose Thick Film Chip Resistor; Manufacturer: GENERIC; Manufacturer1 Part Number: NRC06F39R0TRF; Power: 0.1W; TC: ±100ppm/°C; Table: Resistors SMD; Part Number: R0603_39R_1%_0.1W_100PPM; Component Kind: Standard; Component Type: Standard; Pin Count: 2; Value: 39; Status: Preferred; Tolerance: ±1%; Manufacturer Part Number: R0603_39R_1%_0.1W_100PPM; Case: 0603; Mounted: Yes; Socket: No; SMD: Yes; Manufacturer1 Example: NIC COMPONENT; Manufacturer1 ComponentHeight: 0.55mm; HelpURL: \\cern.ch\dfs\Applications\Altium\Datasheets\R0603_NIC_NRC.pdf; Author: CERN DEM JLC; CreateDate: 2007-12-03; LatestRevisionDate: 2008-03-13
R189 R193 = R1206_0R22_1%_0.5W_600PPM: Resistor - 1%; Part Description: Low Ohmique High Power Chip Resistor; Manufacturer: YAGEO PHYCOMP; Manufacturer Part Number: RL1206FR-7W0R22 (235051912207); Power: 0.5W; TC: ±600ppm/°C; Table: Resistors SMD; Part Number: R1206_0R22_1%_0.5W_600PPM; Component Kind: Standard; Component Type: Standard; Pin Count: 2; Value: 0R22; Status: Not recommended; Tolerance: ±1%; Case: 1206; Mounted: Yes; Socket: No; SMD: Yes; ComponentHeight: 0.65mm; HelpURL: \\cern.ch\dfs\Applications\Altium\Datasheets\R1206_PHYCOMP_LRC02P.pdf; Author: CERN DEM JMW; CreateDate: 2009-01-06; LatestRevisionDate: 2009-01-06
T3 T4 T7 T9 T12 = IRF9910Pbf: Dual SO-8 MOSFET For POL Cconverter; Part Description: 20V 10A(Q1) 20V 12A (Q2) Dual SO-8 MOSFET For POL Cconverter; Manufacturer: INTERNATIONAL RECTIFIER; Table: Transistors; Part Number: IRF9910Pbf; Component Kind: Standard; Component Type: Standard; Device: IRF9910Pbf; PackageDescription: SOIC 8, Pitch 1.27mm - Body 4x5mm, IPC Medium Density; Manufacturer Part Number: IRF9910Pbf; Pin Count: 8; Case: DO8; Mounted: Yes; Socket: No; SMD: Yes; ComponentHeight: 1.75mm; HelpURL: \\cern.ch\dfs\Applications\Altium\Datasheets\IRF9910Pbf.pdf; Author: CERN DEM JLC; CreateDate: 2010-08-30; LatestRevisionDate: 2010-08-30
T11 = BSH103: N-CHANNEL MOSFET WITH DIODE; Part Description: 50V 200mA N-Channel Enhancement Mode Field-Effect Transistor; Manufacturer: NXP SEMICONDUCTORS; Table: Transistors; Part Number: BSH103; Component Kind: Standard; Component Type: Standard; Device: BSH103; PackageDescription: SOT23, 3 pin, Pitch 0.95mm - 1.3mm W X 2.9mm L X 1.1mm H, IPC Medium Density; Manufacturer Part Number: BSH103; Pin Count: 3; Case: SOT23-3; Mounted: Yes; Socket: No; SMD: Yes; ComponentHeight: 1.1mm; HelpURL: \\cern.ch\dfs\Applications\Altium\Datasheets\BSH103.pdf; Author: CERN DEM JLC; CreateDate: 3/16/2010; LatestRevisionDate: 3/16/2010